# Altium schematic sheet PWR-CONNS.SchDoc
size A; SheetNumber: 2; SheetTotal: 2
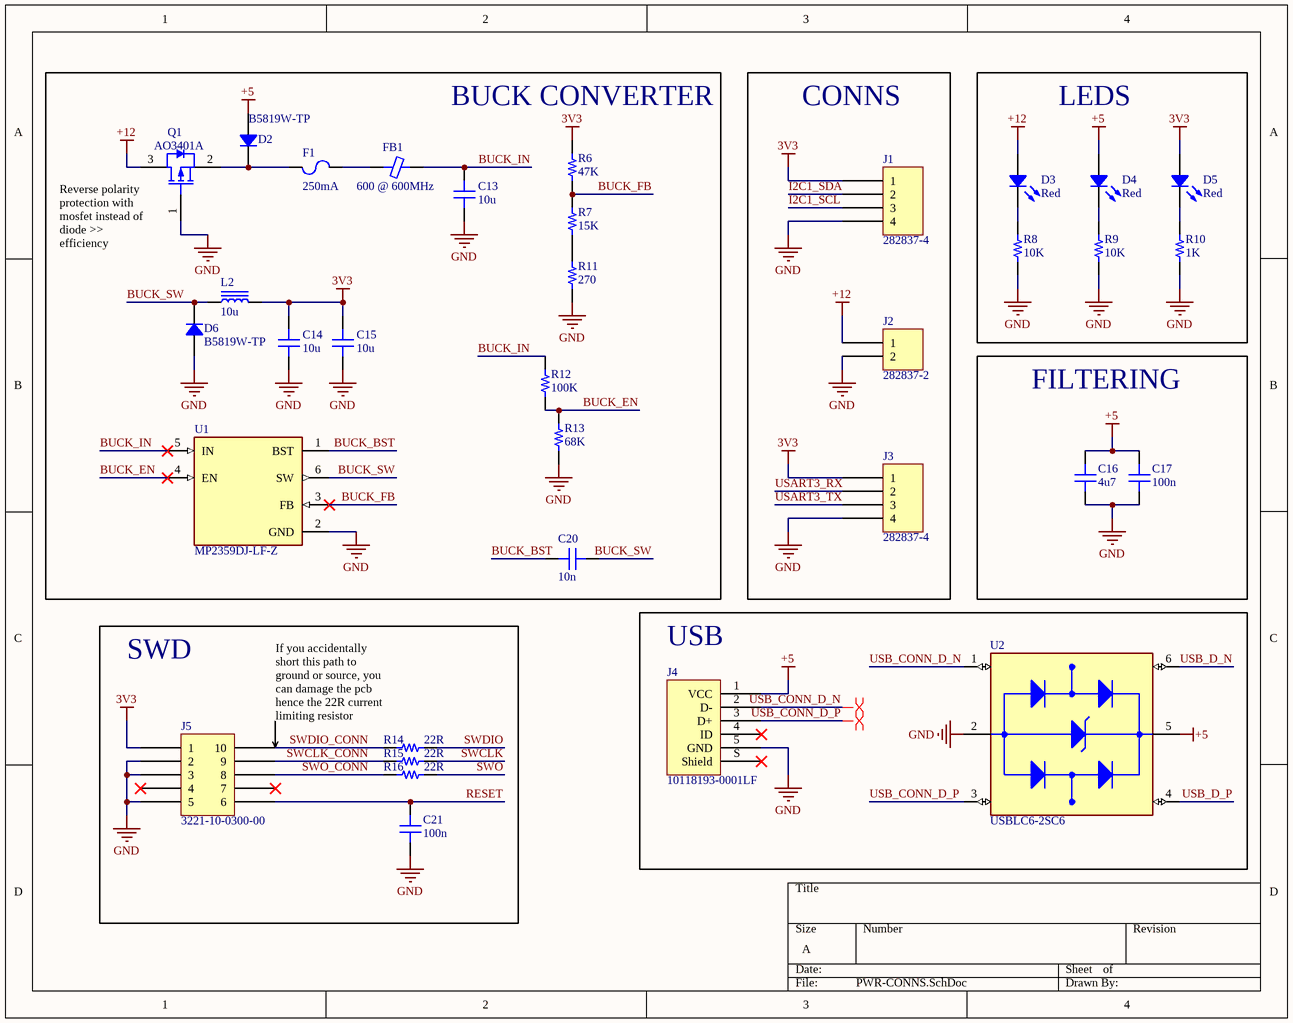
[diagram p0: PWR-CONNS.SchDoc]

## Parts
C13  10u  [CAP 0805_2012]
C14  10u  [CAP 0805_2012]
C15  10u  [CAP 0805_2012]
C16  4u7  [CAP 0603_1608]
C17  100n  [CAP 0603_1608]
C20  10n  [CAP 0805_2012]
C21  100n  [CAP 0603_1608]
D2  B5819W-TP  [SOD-123]
D3  Red  [LED 0603_1608 RED]
D4  Red  [LED 0603_1608 RED]
D5  Red  [LED 0603_1608 RED]
D6  B5819W-TP  [SOD-123]
F1  250mA  [FUSE 1206_3216 0.6MM]
FB1  600 @ 600MHz  [FER 0402_1005]
J1  282837-4  [TE 282837-4]
J2  282837-2  [TE 282837-2]
J3  282837-4  [TE 282837-4]
J4  10118193-0001LF  [FCI USB 10118193-0001LF]
J5  3221-10-0300-00  [CNC TECH 3221-10-0300-00]
L2  10u  [BOURNS SRP5030T]
Q1  AO3401A  [AO-SOT-23-3L_V]
R6  47K  [RES 0603_1608]
R7  15K  [RES 0603_1608]
R8  10K  [RES 0603_1608]
R9  10K  [RES 0603_1608]
R10  1K  [RES 0603_1608]
R11  270  [RES 0603_1608]
R12  100K  [RES 0603_1608]
R13  68K  [RES 0603_1608]
R14  22R  [RES 0603_1608]
R15  22R  [RES 0603_1608]
R16  22R  [RES 0603_1608]
U1  MP2359DJ-LF-Z  [SOT95P280X100-6N]
U2  USBLC6-2SC6  [SOT95P280X145-6N]

## Blocks framed on the sheet
CONNS: J1-J3
LEDS: D3-D5 R8-R10
FILTERING: C16 C17
USB: J4 U2
SWD: C21 J5 R14-R16

## Nets
3V3: C14.2 C15.2 D5.1 J1.1 J3.1 J5.1 L2.2 R6.2
+5: C16.1 C17.1 D2.1 D4.1 J4.1(VCC) U2.5(VBUS)
+12: D3.1 J2.1 Q1.3(DRAIN)
GND: C13.1 C14.1 C15.1 C16.2 C17.2 C21.2 D6.1 J1.4 J2.2 J3.4 J4.5(GND) J5.2 J5.3 J5.5 Q1.1(GATE) R8.1 R9.1 R10.1 R11.1 R13.1 U1.2(GND) U2.2(GND)
BUCK_BST: C20.2 U1.1(BST)
BUCK_EN: R12.1 R13.2 U1.4(EN)
BUCK_FB: R6.1 R7.2 U1.3(FB)
BUCK_IN: C13.2 FB1.2 R12.2 U1.5(IN)
BUCK_SW: C20.1 D6.2 L2.1 U1.6(SW)
I2C1_SCL: J1.3
I2C1_SDA: J1.2
RESET: C21.1 J5.6
SWCLK: R15.1
SWCLK_CONN: J5.9 R15.2
SWDIO: R14.1
SWDIO_CONN: J5.10 R14.2
SWO: R16.1
SWO_CONN: J5.8 R16.2
USART3_RX: J3.2
USART3_TX: J3.3
USB_CONN_D_N: J4.2(D-) U2.1(I/O1_IN)
USB_CONN_D_P: J4.3(D+) U2.3(I/O2_IN)
USB_D_N: U2.6(I/O1_OUT)
USB_D_P: U2.4(I/O2_OUT)
NetD2_2: D2.2 F1.1 Q1.2(SOURCE)
NetD3_2: D3.2 R8.2
NetD4_2: D4.2 R9.2
NetD5_2: D5.2 R10.2
NetF1_2: F1.2 FB1.1
NetR7_1: R7.1 R11.2

Not connected (* = marked no-connect by the designer): J4 4(ID)* S(Shield)*; J5 4* 7*

## Layout directives
differential pair: USB_CONN_D_N, USB_CONN_D_P

## Notes on the sheet
- (near R6) BUCK CONVERTER
- (near Q1) Reverse polarity protection with mosfet instead of diode >> efficiency
- If you accidentally short this path to ground or source, you can damage the pcb hence the 22R current limiting resistor
- Type @ to refer to a designator or a net

## Library data of the parts
C13-C15 C20 = C0805C222K4RAC7800: CAP CER 2200PF 16V X7R 0805; manufacturer: KEMET; Tolerance: ±10%; Part Number: C0805C222K4RAC7800; Applications: Bypass, Decoupling; Capacitance: 2200 pF; componentlink1description: Datasheet; componentlink1url: https://api.kemet.com/component-edge/download/datasheet/C0805C222K4RACTU.pdf; componentlink2description: DigiKey Link; componentlink2url: https://www.digikey.com/en/products/detail/kemet/C0805C222K4RAC7800/2212264; Device Package: 0805 (2012 Metric); lastupdated: 2/9/2024 8:15:14 PM; Lifecycle Status: Active; Minimum Order: 1; Mounting Type: Surface Mount, MLCC; Operating Temperature: -55°C ~ 125°C; Package / Case: 0805 (2012 Metric); packaging: TapeAndReel; partid: 40064; Part Status: Active; price: 0.04; series: SMD Comm X7R; Size / Dimension: 0.079" L x 0.049" W (2.00mm x 1.25mm); Supplier 1: DigiKey; Supplier Part Number 1: 399-C0805C222K4RAC7800CT-ND; Temperature Coefficient: X7R; Thickness (Max): 0.035" (0.88mm); Voltage - Rated: 16V
C16 C17 C21 = C0603C104J4RAC7013: CAP CER SMD 0603 .1UF 5% X7R 16V; manufacturer: KEMET; Capacitance: 0.1 µF; Part Number: C0603C104J4RAC7013; Applications: Bypass, Decoupling; componentlink1description: Datasheet; componentlink1url: https://api.kemet.com/component-edge/download/datasheet/C0603C104J4RAC7013.pdf; componentlink2description: DigiKey Link; componentlink2url: https://www.digikey.com/en/products/detail/kemet/C0603C104J4RAC7013/8572406; Device Package: 0603 (1608 Metric); lastupdated: 2/9/2024 8:10:13 PM; Lifecycle Status: Active; Minimum Order: 1; Mounting Type: Surface Mount, MLCC; Operating Temperature: -55°C ~ 125°C; Package / Case: 0603 (1608 Metric); packaging: TapeAndReel; partid: 40484; Part Status: Active; price: 0.02; series: SMD Comm X7R; Size / Dimension: 0.063" L x 0.031" W (1.60mm x 0.80mm); Supplier 1: DigiKey; Supplier Part Number 1: 399-17571-1-ND; Temperature Coefficient: X7R; Thickness (Max): 0.037" (0.95mm); Tolerance: ±5%; Voltage - Rated: 16V
  C16: Value: 4u7
  C17 C21: Value: 100n
D2 D6 = B5819W-TP: DIODE SCHOTTKY 40V 1A SOD123; Manufacturer: Micro Commercial Co; Capacitance @ Vr, F: 120pF @ 4V, 1MHz; Current - Reverse Leakage @ Vr: 1 mA @ 40 V; Speed: Fast Recovery =< 500ns, > 200mA (Io); Voltage - Forward (Vf) (Max) @ If: 600 mV @ 1 A; Part Number: B5819W-TP; ComponentLink1Description: Datasheet; ComponentLink1URL: https://www.mccsemi.com/pdf/Products/B5817W-B5819W(SOD-123).pdf; ComponentLink2Description: DigiKey Link; ComponentLink2URL: https://www.digikey.com/en/products/detail/micro-commercial-co/B5819W-TP/3774959; Current - Average Rectified (Io): 1A; Diode Type: Schottky; LastUpdated: 2/8/2024 9:27:27 PM; Lifecycle Status: Active; Minimum Order: 1; Mounting Type: Surface Mount; Operating Temperature - Junction: -65°C ~ 125°C; Package / Case: SOD-123; Packaging: TapeAndReel; PartId: 2331; Part Status: Active; Price: 0.03; Series: -; Supplier 1: DigiKey; Supplier Part Number 1: B5819W-TPMSCT-ND; Supplier Device Package: SOD-123; Voltage - DC Reverse (Vr) (Max): 40 V
D3-D5 = APT1608SEC/J3-AMT: LED RED 0603; Manufacturer: Kingbright; Current - Test: 20mA; Lens Color: Colorless; Lens Size: 1.60mm x 0.80mm; Lens Style: Rectangle with Flat Top; Lens Transparency: Clear; Millicandela Rating: 900mcd; Viewing Angle: 120°; Voltage - Forward (Vf) (Typ): 2.2V; Wavelength - Dominant: 623nm; Wavelength - Peak: 640nm; Part Number: APT1608SEC/J3-AMT; Color: Red; ComponentLink1Description: Datasheet; ComponentLink1URL: https://www.kingbrightusa.com/images/catalog/SPEC/APT1608SEC-J3-AMT.pdf; ComponentLink2Description: DigiKey Link; ComponentLink2URL: https://www.digikey.com/en/products/detail/kingbright/APT1608SEC-J3-AMT/17969025; Device Package: 0603 (1608 Metric); Height (Max): 0.85mm; LastUpdated: 2/8/2024 9:32:15 PM; Lifecycle Status: Active; Minimum Order: 1; Mounting Type: Surface Mount; Package / Case: 0603 (1608 Metric); Packaging: TapeAndReel; PartId: 1301; Part Status: Active; Price: 0.23; Series: High Temp; Size / Dimension: 1.60mm L x 0.85mm W; Supplier 1: DigiKey; Supplier Part Number 1: 754-APT1608SEC/J3-AMTCT-ND; Supplier Device Package: 0603; Value: Red
F1 = SF-1206FP050-2: FUSE BOARD MNT 500MA 63VDC 1206; Manufacturer: Bourns Inc.; Approval Agency: UL; Breaking Capacity @ Rated Voltage: 50A; Fuse Type: Board Mount (Cartridge Style Excluded); Melting I²t: 0.015; Response Time: Fast Blow; Voltage Rating - DC: 63V; Part Number: SF-1206FP050-2; Approvals: UL; ComponentLink1Description: Datasheet; ComponentLink1URL: https://www.bourns.com/docs/product-datasheets/sf-1206fp.pdf; ComponentLink2Description: DigiKey Link; ComponentLink2URL: http://digikey.com/product-detail/en/bourns-inc/SF-1206FP050-2/SF-1206FP050-2CT-ND/7652265; Current Rating (Amps): 500mA; Device Package: 1206 (3216 Metric); LastUpdated: 9/2/2020 1:30:42 AM; Lifecycle Status: Active; Minimum Order: 1; Mounting Type: Surface Mount; Operating Temperature: -20°C ~ 105°C; Package / Case: 1206 (3216 Metric); Packaging: TapeAndReel; Part Status: Active; Price: 0.34; Series: SinglFuse™ SF-1206FP; Size / Dimension: 0.122" L x 0.061" W x 0.024" H (3.10mm x 1.55mm x 0.60mm); Supplier 1: DigiKey; Supplier Part Number 1: SF-1206FP050-2CT-ND
FB1 = Z0402C601ESMST: FERRITE BEAD 600 OHM 0402 1LN; Manufacturer: KEMET; Current Rating (Max): 300mA; DC Resistance (DCR) (Max): 600mOhm; Filter Type: Signal Line; Impedance @ Frequency: 600 Ohms @ 100MHz; Number of Lines: 1; Value: 600 Ohms @ 100MHz; Part Number: Z0402C601ESMST; ComponentLink1Description: Datasheet; ComponentLink1URL: https://content.kemet.com/datasheets/F3115.pdf; ComponentLink2Description: DigiKey Link; ComponentLink2URL: http://digikey.com/product-detail/en/kemet/Z0402C601ESMST/399-9606-1-ND/3674215; Device Package: 0402 (1005 Metric); Height (Max): 0.022" (0.55mm); LastUpdated: 2/8/2024 9:23:50 PM; Lifecycle Status: Active; Minimum Order: 1; Mounting Type: Surface Mount; Operating Temperature: -55°C ~ 125°C; Package / Case: 0402 (1005 Metric); Packaging: TapeAndReel; PartId: 516; Part Status: Active; Price: 0.03; Series: Z-SMS; Size / Dimension: 0.039" L x 0.020" W (1.00mm x 0.50mm); Supplier 1: DigiKey; Supplier Part Number 1: 399-9606-1-ND
J1 J3 = 282837-4: TERM BLK 4P SIDE ENT 5.08MM PCB; Manufacturer: TE Connectivity AMP Connectors; Current: 13.5 A; Mating Orientation: Horizontal with Board; Number of Levels: 1; Pitch: 0.200" (5.08mm); Positions Per Level: 4; Voltage: 300 V; Wire Gauge: 16-28 AWG; Wire Termination: Screw - Rising Cage Clamp; Part Number: 282837-4; Color: Green; ComponentLink1Description: Datasheet; ComponentLink1URL: https://www.te.com/commerce/DocumentDelivery/DDEController?Action=srchrtrv&DocNm=282837&DocType=Customer+Drawing&DocLang=English; ComponentLink2Description: DigiKey Link; ComponentLink2URL: https://www.digikey.com/en/products/detail/te-connectivity-amp-connectors/282837-4/2187975; Features: Interlocking (Side); LastUpdated: 6/21/2022 3:00:53 PM; Lifecycle Status: Active; Minimum Order: 1; Mounting Type: Through Hole; Packaging: Tray; Part Status: Active; Price: 0.62; Series: Buchanan; Supplier 1: DigiKey; Supplier Part Number 1: A124423-ND
J2 = 282837-2: TERM BLK 2P SIDE ENT 5.08MM PCB; Manufacturer: TE Connectivity AMP Connectors; Current: 13.5 A; Mating Orientation: Horizontal with Board; Number of Levels: 1; Pitch: 0.200" (5.08mm); Positions Per Level: 2; Voltage: 300 V; Wire Gauge: 16-28 AWG; Wire Termination: Screw - Rising Cage Clamp; Part Number: 282837-2; Color: Green; ComponentLink1Description: Datasheet; ComponentLink1URL: https://www.te.com/commerce/DocumentDelivery/DDEController?Action=srchrtrv&DocNm=282837&DocType=Customer+Drawing&DocLang=English; ComponentLink2Description: DigiKey Link; ComponentLink2URL: https://www.digikey.com/en/products/detail/te-connectivity-amp-connectors/282837-2/2187973; Features: Interlocking (Side); LastUpdated: 6/21/2022 3:00:23 PM; Lifecycle Status: Active; Minimum Order: 1; Mounting Type: Through Hole; Packaging: Tray; Part Status: Active; Price: 0.31; Series: Buchanan; Supplier 1: DigiKey; Supplier Part Number 1: A113320-ND
J4 = 10118193-0001LF: CONN RCPT USB2.0 MICRO B SMD R/A; Manufacturer: Amphenol ICC (FCI); Connector Type: USB - micro B; Current Rating (Amps): 1.8A per Contact; Gender: Receptacle; Mating Cycles: 10000; Number of Contacts: 5; Number of Ports: 1; Shielding: Shielded; Voltage - Rated: 100VAC; Part Number: 10118193-0001LF; ComponentLink1Description: Datasheet; ComponentLink1URL: https://cdn.amphenol-icc.com/media/wysiwyg/files/documentation/datasheet/inputoutput/io_usb_micro.pdf; ComponentLink2Description: DigiKey Link; ComponentLink2URL: //digikey.com/product-detail/en/amphenol-icc-fci/10118193-0001LF/609-4616-2-ND/2785388; Features: Solder Retention; LastUpdated: 12/9/2019 8:51:28 PM; Lifecycle Status: 0; Minimum Order: 1; Mounting Feature: Horizontal; Mounting Type: Surface Mount, Right Angle; Through Hole; Operating Temperature: -30°C ~ 80°C; Packaging: TapeAndReel; Part Status: Active; Price: 0.21; Series: -; Specifications: USB 2.0; Supplier 1: DigiKey; Supplier Part Number 1: 609-4616-2-ND; Termination: Solder
J5 = 3221-10-0300-00: CONN HEADER SMD 10POS 1.27MM; Manufacturer: CNC Tech; Current Rating (Amps): 1A; Material Flammability Rating: UL94 V-0; Number of Positions: 10; Number of Positions Loaded: All; Pitch - Mating: 0.050" (1.27mm); Shrouding: Shrouded - 4 Wall; Style: Board to Cable/Wire; Part Number: 3221-10-0300-00; ComponentLink1Description: Datasheet; ComponentLink1URL: http://cnctech.us/idcmatching2.pdf; ComponentLink2Description: DigiKey Link; ComponentLink2URL: http://digikey.com/product-detail/en/cnc-tech/3221-10-0300-00/1175-1735-ND/4878946; Connector Type: Header; Contact Finish - Mating: Gold; Contact Finish - Post: Gold; Contact Finish Thickness - Mating: Flash; Contact Material: Brass; Contact Shape: Square; Contact Type: Male Pin; Fastening Type: Push-Pull; Features: Keying Slot; Insulation Height: 0.213" (5.40mm); Insulation Material: Polyamide (PA6T), Nylon 6T; LastUpdated: 1/13/2020 12:09:21 AM; Lifecycle Status: Active; Minimum Order: 1; Mounting Type: Surface Mount; Number of Rows: 2; Operating Temperature: -40°C ~ 105°C; Packaging: Tray; PartId: 109; Part Status: Active; Price: 0.73; Row Spacing - Mating: 0.050" (1.27mm); Series: -; Supplier 1: DigiKey; Supplier Part Number 1: 1175-1735-ND; Termination: Solder
L2 = SRP5030T-100M: FIXED IND 10UH 2.75A 128MOHM SMD; Manufacturer: Bourns Inc.; Current - Saturation: 3.5A; DC Resistance (DCR): 128mOhm Max; Inductance: 10 µH; Inductance Frequency - Test: 100 kHz; Material - Core: Iron Powder; Shielding: Shielded; Tolerance: ±20%; Type: Drum Core, Wirewound; Value: 10 µH; Part Number: SRP5030T-100M; ComponentLink1Description: Datasheet; ComponentLink1URL: https://www.bourns.com/docs/Product-Datasheets/SRP5030T.pdf; ComponentLink2Description: DigiKey Link; ComponentLink2URL: https://www.digikey.com/en/products/detail/bourns-inc/SRP5030T-100M/3986087; Current Rating (Amps): 2.75 A; Device Package: Nonstandard; Height - Seated (Max): 0.118" (3.00mm); LastUpdated: 2/8/2024 9:34:53 PM; Lifecycle Status: Active; Minimum Order: 1; Mounting Type: Surface Mount; Operating Temperature: -40°C ~ 125°C; Package / Case: Nonstandard; Packaging: TapeAndReel; PartId: 9; Part Status: Active; Price: 0.59; Series: SRP5030T; Size / Dimension: 0.224" L x 0.205" W (5.70mm x 5.20mm); Supplier 1: DigiKey; Supplier Part Number 1: SRP5030T-100MCT-ND
Q1 = CMP-2000-05778-1: P-Channel MOSFET, 30 V, 4 A, -55 to 150 degC, 3-Pin SOT-23-3L, RoHS, Tape and Reel; Manufacturer: Alpha and Omega; Output Power (Max): NotRequiredW; Power Dissipation: 1.4W; Rad Hardened: No; Drain Efficiency: NotRequired%; Drain-Source On-Volt: 30V; Noise Figure: NotRequireddB; Frequency (Max): NotRequiredMHz; Number of  Elements: 1; Gate-Source Voltage (Max): ?12V; Drain Current (Max): 4A; Channel Mode: Enhancement; Drain-Source On-Res: 0.044ohm; Type: PowerMOSFET; Polarity: P; Package URL: http://www.aosmd.com/res/packaging_information/SOT-23-3L.pdf; Datasheet URL: http://www.aosmd.com/res/data_sheets/AO3401A.pdf; Package Type: SOT-23; Package Description: 3-Pin Small Outline Transistor, Body 2.95 x 1.6 mm, Pitch 0.95 mm; Mounting: SurfaceMount; Manufacturer URL: http://www.aosmd.com/; Continuous Drain Current: 4A; Package Reference: SOT-23-3L; Mounting Technology: SurfaceMount; Operating Temperature Classification: Military; Power Gain: NotRequireddB; Datasheet Version: Rev. 3, 03/2011; Operating Temp Range: -55Cto150C; Pin Count: 3
R6-R16 = AC0603FR-0747RL: RES SMD 47 OHM 1% 1/10W 0603; Manufacturer: Yageo; Power (Watts): 0.1W, 1/10W; Resistance: 47 Ohms; Temperature Coefficient: ±100ppm/°C; Part Number: AC0603FR-0747RL; ComponentLink1Description: Datasheet; ComponentLink1URL: https://www.yageo.com/upload/media/product/productsearch/datasheet/rchip/PYu-AC_51_RoHS_L_7.pdf; ComponentLink2Description: DigiKey Link; ComponentLink2URL: https://www.digikey.com/en/products/detail/yageo/AC0603FR-0747RL/2827825; Composition: Thick Film; Device Package: 0603 (1608 Metric); Features: Automotive AEC-Q200, Moisture Resistant; Height - Seated (Max): 0.022" (0.55mm); LastUpdated: 2/9/2024 8:42:47 PM; Lifecycle Status: Active; Minimum Order: 1; Number of Terminations: 2; Operating Temperature: -55°C ~ 155°C; Package / Case: 0603 (1608 Metric); Packaging: CutTape; PartId: 17426; Part Status: Active; Price: 0.01; Ratings: AEC-Q200; Series: AC; Size / Dimension: 0.063" L x 0.031" W (1.60mm x 0.80mm); Supplier 1: DigiKey; Supplier Part Number 1: 311-47LDCT-ND; Supplier Device Package: 0603; Tolerance: ±1%
  R6: Value: 47K
  R7: Value: 15K
  R8 R9: Value: 10K
  R10: Value: 1K
  R11: Value: 270
  R12: Value: 100K
  R13: Value: 68K
  R14-R16: Value: 22R
U1 = MP2359DJ-LF-Z: Buck Switching Regulator IC Positive Adjustable 0.81V 1 Output 1.2A SOT-23-6 Thin, TSOT-23-6; MF: Monolithic Power; SnapEDA_Link: https://www.snapeda.com/parts/MP2359DJ-LF-Z/Monolithic+Power+Systems+Inc./view-part/?ref=snap; Package: TSOT-23-6 Monolithic Power Systems; Value: *; MP: MP2359DJ-LF-Z; Check_prices: https://www.snapeda.com/parts/MP2359DJ-LF-Z/Monolithic+Power+Systems+Inc./view-part/?ref=eda
U2 = USBLC6-2SC6: 17V Clamp 5A (8/20Âµs) Ipp Tvs Diode Surface Mount SOT-23-6; MF: STMicroelectronics; Value: *; SnapEDA_Link: https://www.snapeda.com/parts/USBLC6-2SC6/STMicroelectronics/view-part/?ref=snap; Check_prices: https://www.snapeda.com/parts/USBLC6-2SC6/STMicroelectronics/view-part/?ref=eda; Purchase-URL: https://pricing.snapeda.com/search/part/USBLC6-2SC6/?ref=eda; Price: None; Availability: In Stock; Package: SOT-23-6 STMicroelectronics; MP: USBLC6-2SC6